# EAGLE design mcp23007_uln2803a_fabricated (EAGLE 7.6.0)
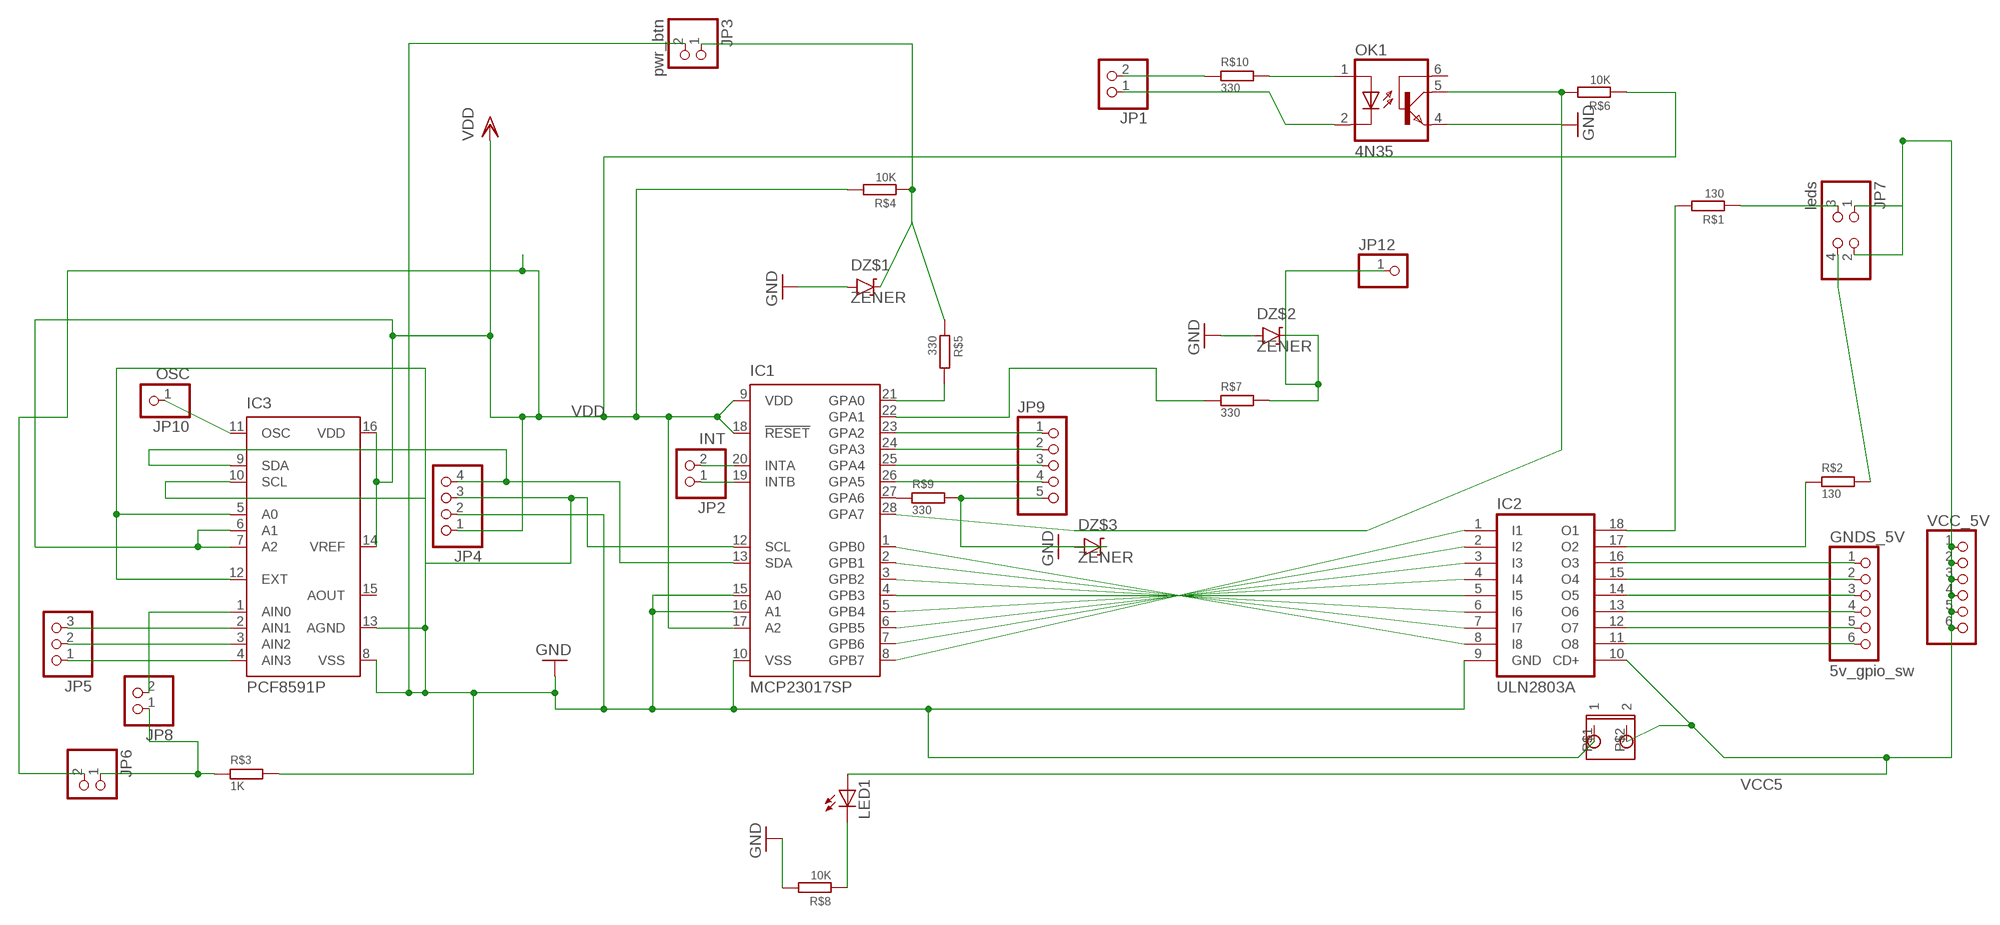
[diagram p0: schematic, sheet 1]

## Parts
DZ$1  ZENER  [ZENER]
DZ$2  ZENER  [ZENER]
DZ$3  ZENER  [ZENER]
GNDS_5V  5v_gpio_sw  PINHD-1X6  [1X06]
IC1  MCP23017SP  [DIL28-3]
IC2  ULN2803A  [DIL18]
IC3  PCF8591P  [DIL16]
JP1  PINHD-1X2  [1X02]
JP2  INT  PINHD-1X2  [1X02]
JP3  pwr_btn  PINHD-1X2  [1X02]
JP4  PINHD-1X4  [1X04]
JP5  PINHD-1X3  [1X03]
JP6  PINHD-1X2  [1X02]
JP7  leds  PINHD-2X2  [2X02]
JP8  PINHD-1X2  [1X02]
JP9  PINHD-1X5  [1X05]
JP10  OSC  PINHD-1X1  [1X01]
JP12  PINHD-1X1  [1X01]
LED1  LED3MM  [LED3MM]
OK1  4N35  [DIL06]
R$1  130  RESISTOR  [RESISTOR_1/4]
R$2  130  RESISTOR  [RESISTOR_1/4]
R$3  1K  RESISTOR  [RESISTOR_1/4]
R$4  10K  RESISTOR  [RESISTOR_1/4]
R$5  330  RESISTOR  [RESISTOR_1/4]
R$6  10K  RESISTOR  [RESISTOR_1/4]
R$7  330  RESISTOR  [RESISTOR_1/4]
R$8  10K  RESISTOR  [RESISTOR_1/4]
R$9  330  RESISTOR  [RESISTOR_1/4]
R$10  330  RESISTOR  [RESISTOR_1/4]
U$1  5.5MM_PIN  [5.5MM_PIN]
VCC_5V  PINHD-1X6  [1X06]

## Nets
GND: DZ$1.P$1 DZ$2.P$1 DZ$3.P$1 IC1.10(VSS) IC1.15(A0) IC1.16(A1) IC2.9(GND) IC3.5(A0) IC3.8(VSS) IC3.12(EXT) IC3.13(AGND) JP3.2 JP4.2 OK1.4(EMI) R$3.P$1 R$8.P$1 U$1.P$1
N$1: IC1.1(GPB0) IC2.8(I8)
N$2: IC1.8(GPB7) IC2.1(I1)
N$3: IC1.7(GPB6) IC2.2(I2)
N$4: IC1.2(GPB1) IC2.7(I7)
N$5: IC1.6(GPB5) IC2.3(I3)
N$6: IC1.3(GPB2) IC2.6(I6)
N$7: IC1.5(GPB4) IC2.4(I4)
N$8: IC1.4(GPB3) IC2.5(I5)
N$9: IC1.28(GPA7) OK1.5(COL) R$6.P$1
N$10: IC1.22(GPA1) R$7.P$2
N$11: IC1.23(GPA2) JP9.1
N$12: IC1.24(GPA3) JP9.2
N$13: IC1.25(GPA4) JP9.3
N$14: IC1.26(GPA5) JP9.4
N$15: IC1.27(GPA6) R$9.P$2
N$16: DZ$2.P$2 JP12.1 R$7.P$1
N$17: IC2.17(O2) R$2.P$2
N$18: IC3.11(OSC) JP10.1
N$19: GNDS_5V.1 IC2.16(O3)
N$20: GNDS_5V.2 IC2.15(O4)
N$21: GNDS_5V.3 IC2.14(O5)
N$22: GNDS_5V.4 IC2.13(O6)
N$23: GNDS_5V.5 IC2.12(O7)
N$24: GNDS_5V.6 IC2.11(O8)
N$25: DZ$1.P$2 JP3.1 R$4.P$2 R$5.P$2
N$26: IC1.19(INTB) JP2.1
N$27: IC1.20(INTA) JP2.2
N$28: IC1.13(SDA) IC3.9(SDA) JP4.4
N$29: IC1.12(SCL) IC3.10(SCL) JP4.3
N$30: IC3.4(AIN3) JP5.1
N$31: IC3.3(AIN2) JP5.2
N$32: IC3.2(AIN1) JP5.3
N$33: IC3.1(AIN0) JP8.2
N$34: LED1.K(C) R$8.P$2
N$35: JP7.3 R$1.P$2
N$36: IC2.18(O1) R$1.P$1
N$39: JP7.4 R$2.P$1
N$41: DZ$3.P$2 JP9.5 R$9.P$1
N$42: JP1.2 R$10.P$2
N$81: OK1.1(A) R$10.P$1
N$82: JP6.1 JP8.1 R$3.P$2
N$83: IC1.21(GPA0) R$5.P$1
N$84: JP1.1 OK1.2(C)
VCC5: IC2.10(CD+) JP7.1 JP7.2 LED1.A U$1.P$2 VCC_5V.1 VCC_5V.2 VCC_5V.3 VCC_5V.4 VCC_5V.5 VCC_5V.6
VDD: IC1.9(VDD) IC1.17(A2) IC1.18(!RESET) IC3.6(A1) IC3.7(A2) IC3.14(VREF) IC3.16(VDD) JP4.1 JP6.2 R$4.P$1 R$6.P$2
Unconnected: IC3.15(AOUT) OK1.6(BAS)

## Library data of the parts
DZ$1-DZ$3 = pigoda:ZENER: zener diode
GNDS_5V VCC_5V = pinhead:PINHD-1X6: PIN HEADER
IC1 = microchip:MCP23017: http://ww1.microchip.com/downloads/en/DeviceDoc/21952a.pdf Source: http://ww1.microchip.com/downloads/en/DeviceDoc/21952a.pdf; MF: MICROCHIP; MPN: MCP23017-E/SP; OC_FARNELL: 1332088; OC_NEWARK: 31K2959
IC2 = uln-udn:ULN2803A: DRIVER ARRAY
IC3 = micro-philips:PCF8591: I2C-Bus D/A CONVERTER; MF: FARNELL; MPN: PCF8591P; OC_FARNELL: 396412; OC_NEWARK: 07WX3385
JP1-JP3 JP6 JP8 = pinhead:PINHD-1X2: PIN HEADER
JP4 = pinhead:PINHD-1X4: PIN HEADER
JP5 = pinhead:PINHD-1X3: PIN HEADER
JP7 = pinhead:PINHD-2X2: PIN HEADER
JP9 = pinhead:PINHD-1X5: PIN HEADER
JP10 = pinhead:PINHD-1X1: PIN HEADER
JP12 = adafruit:PINHD-1X1: Pin header 1x1 for 0.1" spacing With round pins
LED1 = adafruit:LED: LED OSRAM: - CHIPLED LG R971, LG N971, LY N971, LG Q971, LY Q971, LO R971, LY R971 LH N974, LH R974 LS Q976, LO Q976, LY Q976 LO Q996 - Hyper CHIPLED LW Q18S LB Q993, LB Q99A, LB R99A - SideLED LS A670, LO A670, LY A670, LG A670, LP A670 LB A673, LV A673, LT A673, LW A673 LH A674 LY A675 LS A676, LA A676, LO A676, LY A676, LW A676 LS A679, LY A679, LG A679 - Hyper Micro SIDELED® LS Y876, LA Y876, LO Y876, LY Y876 LT Y87S - SmartLED LW L88C, LW L88S LB L89C, LB L89S, LG L890 LS L89K, LO L89K, LY L89K LS L896, LA L896, LO L896, LY L896 - TOPLED LS T670, LO T670, LY T670, LG T670, LP T670 LSG T670, LSP T670, LSY T670, LOP T670, LYG T670 LG T671, LOG T671, LSG T671 LB T673, LV T673, LT T673, LW T673 LH T674 LS T676, LA T676, LO T676, LY T676, LB T676, LH T676, LSB T676, LW T676 LB T67C, LV T67C, LT T67C, LS T67K, LO T67K, LY T67K, LW E67C LS E67B, LA E67B, LO E67B, LY E67B, LB E67C, LV E67C, LT E67C LW T67C LS T679, LY T679, LG T679 LS T770, LO T770, LY T770, LG T770, LP T770 LB T773, LV T773, LT T773, LW T773 LH T774 LS E675, LA E675, LY E675, LS T675 LS T776, LA T776, LO T776, LY T776, LB T776 LHGB T686 LT T68C, LB T68C - Hyper Mini TOPLED® LB M676 - Mini TOPLED Santana® LG M470 LS M47K, LO M47K, LY M47K Source: http://www.osram.convergy.de/
OK1 = optocoupler:4N35: MOTOROLA OPTO COUPLER; MF: FAIRCHILD SEMICONDUCTOR; MPN: 4N35; OC_FARNELL: 1328375; OC_NEWARK: 72K9946
R$1-R$10 = pigoda:RESISTOR
U$1 = pigoda:5.5MM_PIN

## Board
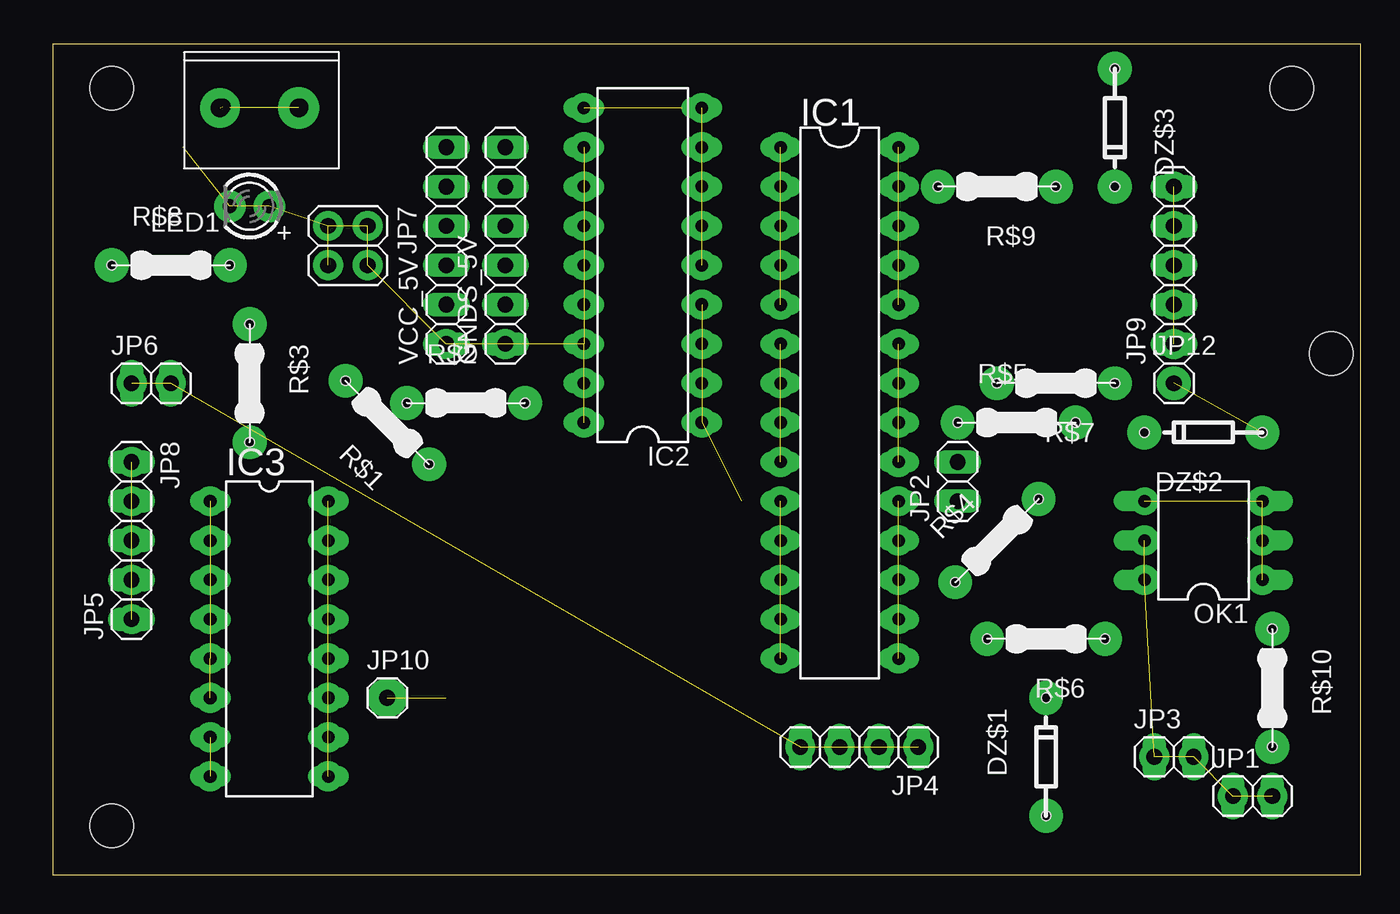
[diagram p1: board, top side]
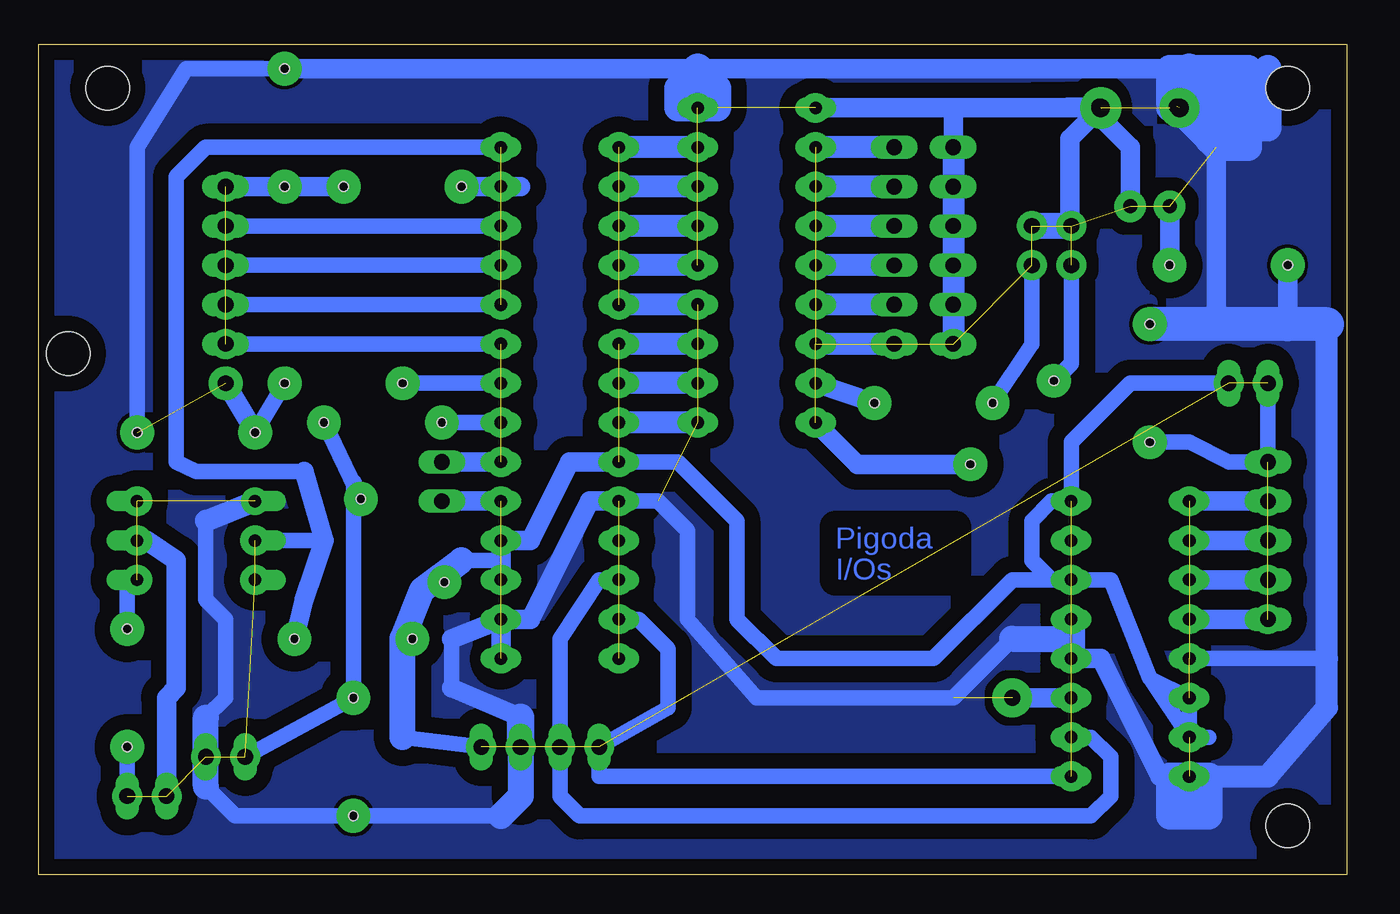
[diagram p2: board, bottom side, seen from below]

Size 84.45 x 53.65 mm. Coordinates in mm from the lower left corner, seen from the top.
Outline: 0,0 84.45,0 84.45,53.65 0,53.65 0,0
Copper layers (1*16): Top 0.035mm / dielectric 1.5mm / Bottom 0.035mm
Design rules "default": minimum track width 10mil, minimum drill 24mil, track to track 8mil, track to pad 8mil, pad to pad 8mil, via to via 8mil, smd to smd 8mil, copper to edge 40mil, drill to drill 8mil, minimum pad ring 10mil, minimum via ring 8mil, stop-mask expansion 4mil, vias tented up to drill 0mil, thermal gap 10mil
Holes 2.8 mm at 3.81,50.8 80.01,50.8 82.55,33.66 3.81,3.17

### Footprints (pad centres in the part's own frame; a part is rotated, then mirrored left to right if it is on the bottom)
ZENER = drill 0.7 pad 2.184: P$1 -3.81,0; P$2 3.81,0 | hole 0.6: -3.81,0; 3.81,0
1X06 = drill 1.016 long: 1 -6.35,0; 2 -3.81,0; 3 -1.27,0; 4 1.27,0; 5 3.81,0; 6 6.35,0
DIL28-3 = drill 0.813 long: 1 -16.51,-3.81; 2 -13.97,-3.81; 3 -11.43,-3.81; 4 -8.89,-3.81; 5 -6.35,-3.81; 6 -3.81,-3.81; 7 -1.27,-3.81; 8 1.27,-3.81; 9 3.81,-3.81; 10 6.35,-3.81; 11 8.89,-3.81; 12 11.43,-3.81; 13 13.97,-3.81; 14 16.51,-3.81; 15 16.51,3.81; 16 13.97,3.81; 17 11.43,3.81; 18 8.89,3.81; 19 6.35,3.81; 20 3.81,3.81; 21 1.27,3.81; 22 -1.27,3.81; 23 -3.81,3.81; 24 -6.35,3.81; 25 -8.89,3.81; 26 -11.43,3.81; 27 -13.97,3.81; 28 -16.51,3.81
DIL18 = drill 0.813 long: 1 -10.16,-3.81; 2 -7.62,-3.81; 3 -5.08,-3.81; 4 -2.54,-3.81; 5 0,-3.81; 6 2.54,-3.81; 7 5.08,-3.81; 8 7.62,-3.81; 9 10.16,-3.81; 10 10.16,3.81; 11 7.62,3.81; 12 5.08,3.81; 13 2.54,3.81; 14 0,3.81; 15 -2.54,3.81; 16 -5.08,3.81; 17 -7.62,3.81; 18 -10.16,3.81
DIL16 = drill 0.813 long: 1 -8.89,-3.81; 2 -6.35,-3.81; 3 -3.81,-3.81; 4 -1.27,-3.81; 5 1.27,-3.81; 6 3.81,-3.81; 7 6.35,-3.81; 8 8.89,-3.81; 9 8.89,3.81; 10 6.35,3.81; 11 3.81,3.81; 12 1.27,3.81; 13 -1.27,3.81; 14 -3.81,3.81; 15 -6.35,3.81; 16 -8.89,3.81
1X02 = drill 1.016 long: 1 -1.27,0; 2 1.27,0
1X04 = drill 1.016 long: 1 -3.81,0; 2 -1.27,0; 3 1.27,0; 4 3.81,0
1X03 = drill 1.016 long: 1 -2.54,0; 2 0,0; 3 2.54,0
2X02 = drill 1.016 octagon: 1 -1.27,-1.27; 2 -1.27,1.27; 3 1.27,-1.27; 4 1.27,1.27
1X05 = drill 1.016 long: 1 -5.08,0; 2 -2.54,0; 3 0,0; 4 2.54,0; 5 5.08,0
1X01 = drill 1.016 octagon: 1 0,0
1X01' = drill 1.016 pad 1.93 octagon: 1 0,0
LED3MM = drill 0.813 pad 1.676 octagon: A -1.27,0; K 1.27,0
DIL06 = drill 0.813 offset: 1 -2.54,-3.81; 2 0,-3.81; 3 2.54,-3.81; 4 2.54,3.81; 5 0,3.81; 6 -2.54,3.81
RESISTOR_1/4 = drill 0.7 pad 2.184: P$1 -3.81,0; P$2 3.81,0 | hole 0.6: -3.81,0; 3.81,0
5.5MM_PIN = drill 1 pad 2.184: P$1 -3,2; P$2 2,2

### Placement (x,y rotation side)
DZ$1  64.13,7.62 90 top
DZ$2  74.29,28.57 180 top
DZ$3  68.58,48.26 270 top
GNDS_5V  29.21,40.64 90 top
IC1  50.8,30.48 270 top
IC2  38.1,39.37 90 top
IC3  13.97,15.24 270 top
JP1  77.47,5.08 0 top
JP2  58.42,25.4 90 top
JP3  72.39,7.62 0 top
JP4  52.07,8.26 180 top
JP5  5.08,19.05 90 top
JP6  6.35,31.75 0 top
JP7  19.05,40.64 270 top
JP8  5.08,25.4 270 top
JP9  72.39,39.37 90 top
JP10  21.59,11.43 0 top
JP12  [1X01']  72.39,31.75 0 top
LED1  12.7,43.18 180 top
OK1  74.29,21.59 90 top
R$1  21.59,29.21 135 top
R$2  26.67,30.48 0 top
R$3  12.7,31.75 270 top
R$4  60.96,21.59 45 top
R$5  62.23,29.21 0 top
R$6  64.13,15.24 180 top
R$7  64.77,31.75 180 top
R$8  7.62,39.37 0 top
R$9  60.96,44.45 180 top
R$10  78.74,12.06 270 top
U$1  13.97,47.62 0 top
VCC_5V  25.4,40.64 90 top

### Tracks (layer width: path | path; a pad name or v marks a point on that pad's centre or on a via)
GND  (via drill 0.8 pad 1.93, 0.9 pad 1.93, 0.9 pad 2.03, 0.9 pad 2.18, 1 pad 2.54, 1.2 pad 2.54, 1.2 pad 2.67)  (30 unrouted)
  Bottom 1.016: 57.79,15.24 57.79,12.06 | IC3.5 1.27,13.97 | 73.66,5.71 71.75,3.81 DZ$1.P$1 54.61,3.81 | 73.66,10.16 72.39,11.43 72.39,16.51 73.66,17.78 73.66,22.86 | IC1.10 44.45,24.13 42.55,22.23 42.55,16.51 38.1,11.43 25.4,11.43 21.59,15.24 | 53.34,5.08 JP4.2 | DZ$2.P$1 78.1,46.99 74.93,52.07 58.42,52.07
  Bottom 1.27: 57.79,12.06 53.34,10.16 | IC1.16 57.79,15.24 | IC1.15 IC1.16 | IC1.16 52.7,16.51 48.9,24.13 IC1.10 | 18.41,13.97 IC3.12 15.88,13.97 12.07,6.35 IC3.8 | R$3.P$1 8.43,36.02 8.43,46.99 8.89,47.45 | 10.16,52.07 41.91,52.07 58.42,52.07 DZ$3.P$1 | R$8.P$1 3.81,35.56
  Bottom 1.422: IC3.8 5.08,6.35 1.27,10.79 1.27,13.97 1.27,35.56 | 73.66,22.86 OK1.4
  Bottom 1.676: 73.66,5.71 JP3.2 73.66,10.16 | 54.61,3.81 53.34,5.08 | 21.59,15.24 17.78,15.24
  Bottom 1.778: 53.34,10.16 JP4.2 | IC3.13 17.78,15.24 IC3.12 | U$1.P$1 8.43,46.99 | 10.16,49.53 8.89,47.45 | IC3.8 11.43,6.35 11.43,3.81 8.89,3.81 8.89,6.35 IC3.8 | IC3.8 10.16,5.08 | v10.8,49.53 8.89,49.53 8.89,50.8 11.43,50.8 | 11.43,50.8 11.43,49.53 v10.8,49.53 | v10.8,49.53 7.62,49.53 | 7.62,49.53 7.62,48.26 | 7.62,49.53 7.62,52.07 8.89,52.07 8.89,48.26 7.62,48.26 | 7.62,49.53 6.35,49.53 6.35,52.07 11.43,52.07 11.43,50.8 | 7.62,48.26 7.62,46.99 6.35,46.99 6.35,48.26 5.08,48.26 5.08,52.07
  Bottom 1.93: IC2.9 41.91,52.07 | 10.16,52.07 10.16,49.53
  Bottom 2.184: 1.27,35.56 3.81,35.56 R$3.P$1
  other vias: 10.16,24.13 10.16,21.59 10.16,19.05 10.16,16.51 10.16,13.97 10.16,11.43 10.16,8.89 10.16,6.35 72.39,31.75 17.78,39.37 20.32,39.37 20.32,41.91 17.78,41.91 21.59,11.43 13.97,43.18 11.43,43.18 34.29,44.45 34.29,41.91 34.29,39.37 34.29,36.83 34.29,34.29 34.29,31.75 34.29,29.21 41.91,29.21 41.91,31.75 41.91,34.29 41.91,36.83 34.29,46.99 15.88,49.53 21.59,11.43 25.4,34.29 29.21,34.29
  pour Bottom (isolate 1.016): -1.27,56.52 -0.64,0.64 84.45,0.64 83.82,55.24
N$1
  Bottom 1.422: IC2.8 IC1.1
N$2
  Bottom 1.422: IC2.1 IC1.8
N$3
  Bottom 1.422: IC2.2 IC1.7
N$4
  Bottom 1.422: IC2.7 IC1.2
N$5
  Bottom 1.422: IC2.3 IC1.6
N$6
  Bottom 1.422: IC2.6 IC1.3
N$7
  Bottom 1.422: IC2.4 IC1.5
N$8
  Bottom 1.422: IC2.5 IC1.4
N$9
  Bottom 1.016: IC1.28 73.66,46.99 75.56,45.09 75.56,26.67 74.29,26.04 67.31,26.04 | OK1.5 66.04,21.59
  Bottom 1.27: 67.31,26.04 66.04,21.59 67.31,17.78 R$6.P$1
N$10
  Bottom 1.016: R$7.P$2 IC1.22
N$11
  Bottom 1.016: IC1.23 JP9.1
N$12
  Bottom 1.016: JP9.2 IC1.24
N$13
  Bottom 1.016: JP9.3 IC1.25
N$14
  Bottom 1.016: JP9.4 IC1.26
N$15
  Bottom 1.27: R$9.P$2 IC1.27 53.34,44.45
N$16
  Bottom 1.016: R$7.P$1 DZ$2.P$2
  Bottom 1.27: JP12.1 DZ$2.P$2
N$17
  Bottom 1.27: IC2.17 R$2.P$2
N$18
  Bottom 1.27: JP10.1 IC3.11
N$19
  Bottom 1.422: GNDS_5V.1 IC2.16
N$20
  Bottom 1.422: GNDS_5V.2 IC2.15
N$21
  Bottom 1.422: GNDS_5V.3 IC2.14
N$22
  Bottom 1.422: GNDS_5V.4 IC2.13
N$23
  Bottom 1.422: GNDS_5V.5 IC2.12
N$24
  Bottom 1.422: GNDS_5V.6 IC2.11
N$25
  Bottom 1.016: R$5.P$2 R$4.P$2 64.13,25.4 DZ$1.P$2 JP3.1
N$26
  Bottom 1.27: IC1.19 JP2.1
N$27
  Bottom 1.27: IC1.20 JP2.2
N$28
  Bottom 1.016: IC3.9 48.26,6.35 JP4.4 43.81,10.79 43.81,14.61 45.72,16.51 IC1.13
N$29
  Bottom 1.016: IC1.12 48.26,19.05 50.8,15.24 JP4.3 50.8,5.08 49.53,3.81 16.51,3.81 15.24,5.08 15.24,7.62 16.51,8.89 IC3.10
N$30
  Bottom 1.27: IC3.4 JP5.1
N$31
  Bottom 1.27: JP5.2 IC3.3
N$32
  Bottom 1.27: JP5.3 IC3.2
N$33
  Bottom 1.27: IC3.1 JP8.2
N$34
  Bottom 1.27: R$8.P$2 LED1.K
N$35
  Bottom 1.016: JP7.3 17.78,33.02 R$1.P$2
N$36
  Bottom 1.27: R$1.P$1 31.6,26.52 IC2.18
N$38
  Bottom 1.016: 46.99,24.13 45.72,24.13
N$39
  Bottom 1.016: R$2.P$1 20.32,34.29 JP7.4
N$40
  Bottom 1.676: 53.34,8.89 53.34,5.08
N$41
  Bottom 1.27: R$9.P$1 DZ$3.P$2 JP9.5
N$42
  Bottom 1.016: R$10.P$2 JP1.2
N$44  (via drill 0.8 pad 1.93)  (5 unrouted)
  Bottom 1.778: v41.91,49.53 40.64,49.53 40.64,50.8 43.18,50.8 43.18,49.53 v41.91,49.53
  other vias: 41.91,44.45 41.91,41.91 41.91,39.37 41.91,46.99 34.29,49.53
N$46  (via drill 0.8 pad 1.93)  (7 unrouted)
  other vias: 17.78,24.13 17.78,21.59 17.78,19.05 17.78,16.51 17.78,13.97 17.78,11.43 17.78,8.89 17.78,6.35
N$47  (via drill 0.8 pad 1.93)  (3 unrouted)
  other vias: 46.99,26.67 46.99,29.21 46.99,31.75 46.99,34.29
N$48  (via drill 0.8 pad 1.93)  (4 unrouted)
  other vias: 46.99,41.91 46.99,39.37 46.99,36.83 46.99,44.45 46.99,46.99
N$49  (via drill 0.8 pad 1.93)  (3 unrouted)
  other vias: 54.61,26.67 54.61,29.21 54.61,31.75 54.61,34.29
N$50  (via drill 0.8 pad 1.93)  (4 unrouted)
  other vias: 54.61,41.91 54.61,39.37 54.61,36.83 54.61,44.45 54.61,46.99
N$51  (via drill 0.8 pad 1.93)  (4 unrouted)
  other vias: 46.99,19.05 46.99,16.51 46.99,13.97 46.99,21.59 46.99,24.13
N$52  (via drill 0.8 pad 1.93)  (4 unrouted)
  other vias: 54.61,19.05 54.61,16.51 54.61,13.97 54.61,21.59 54.61,24.13
N$53  (via drill 0.8 pad 1.93)  (5 unrouted)
  other vias: 70.48,19.05 70.48,21.59 78.74,5.08 76.2,5.08 73.66,7.62 71.12,7.62
N$54  (via drill 0.8 pad 1.78, 0.8 pad 1.93)  (3 unrouted)
  other vias: 78.1,19.05 78.1,21.59 78.1,24.13 70.48,24.13
N$55  (via drill 0.8 pad 1.93)  (4 unrouted)
  other vias: 72.39,39.37 72.39,36.83 72.39,34.29 72.39,41.91 72.39,44.45
N$56  (via drill 0.8 pad 1.93)  (5 unrouted)
  other vias: 48.26,8.26 50.8,8.26 53.34,8.26 55.88,8.26 5.08,31.75 7.62,31.75
N$57  (via drill 0.8 pad 1.93)  (4 unrouted)
  other vias: 5.08,26.67 5.08,24.13 5.08,21.59 5.08,19.05 5.08,16.51
N$81
  Bottom 1.016: R$10.P$1 78.74,19.05
  Bottom 1.27: OK1.1 78.74,19.05
N$82
  Bottom 1.016: JP6.1 JP8.1 7.62,26.67 10.16,27.94 R$3.P$2
N$83
  Bottom 1.016: IC1.21 R$5.P$1
N$84
  Bottom 1.27: OK1.2 77.47,21.59 75.56,20.32 75.56,12.06 76.2,11.43 JP1.1
VCC5
  Bottom 1.27: 20.32,49.53 U$1.P$2 15.88,49.53 17.88,47.53 17.88,41.81 JP7.1 | IC2.10 25.4,49.53 | VCC_5V.6 25.4,49.53 | 25.4,49.53 20.32,49.53 | 20.32,49.53 16.51,49.53 13.97,46.99 LED1.A
  Bottom 1.422: VCC_5V.6 VCC_5V.5 VCC_5V.4 VCC_5V.3 VCC_5V.2 VCC_5V.1
  Bottom 1.676: JP7.1 JP7.2
VDD
  Bottom 1.016: IC3.7 IC3.6 12.7,12.7 | 8.89,8.89 IC3.7 | IC3.7 12.7,12.7 | 12.7,12.7 15.24,19.05 IC3.14 19.05,19.05 | 17.78,25.4 IC3.16 | IC3.16 17.78,27.94 13.97,31.75 JP6.2 | JP4.1 60.96,8.89 | 54.61,20.32 57.15,20.32 57.3,20.17 R$4.P$1 | R$6.P$2 60.96,15.24 | IC1.9 43.18,26.67 39.37,22.86 39.37,16.51 36.83,13.97 26.67,13.97 21.59,19.05 19.05,19.05 | 19.05,19.05 20.32,20.32 20.32,22.86 19.05,24.13 IC3.16
  Bottom 1.27: IC1.17 54.61,20.32 IC1.18 52.7,21.59 50.16,26.67 IC1.9
  Bottom 1.676: 60.96,8.89 60.96,15.24 59.69,18.41 57.15,20.32

### Text on the board
Bottom: Pigoda / I/Os